# Altium schematic sheet Supply.SchDoc
size A4
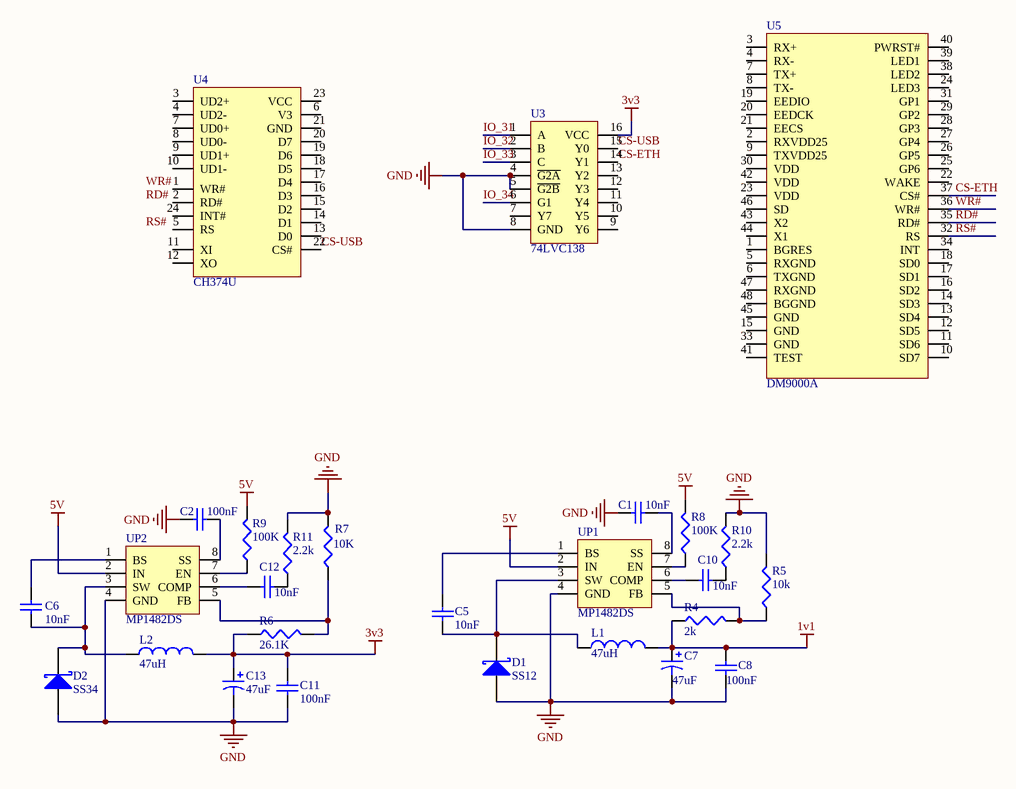
[diagram p0: Supply.SchDoc]

## Parts
C1  value 10nF  [6-0805_M]  (hidden comment: Cap)
C2  value 100nF  [6-0805_M]  (hidden comment: Cap)
C5  value 10nF  [6-0805_M]  (hidden comment: Cap)
C6  value 10nF  [6-0805_M]  (hidden comment: Cap)
C7  value 47uF  [TanCap-1210]  (hidden comment: Cap Pol3)
C8  value 100nF  [6-0805_M]  (hidden comment: Cap)
C10  value 10nF  [6-0805_M]  (hidden comment: Cap)
C11  value 100nF  [6-0805_M]  (hidden comment: Cap)
C12  value 10nF  [6-0805_M]  (hidden comment: Cap)
C13  value 47uF  [TanCap-1210]  (hidden comment: Cap Pol3)
D1  SS12  [SMB]
D2  SS34  [SMB]
L1  value 47uH  [PIND2020]  (hidden comment: Inductor)
L2  value 47uH  [PIND2020]  (hidden comment: Inductor)
R4  value 2k  [6-0805_M]  (hidden comment: Res3)
R5  value 10k  [6-0805_M]  (hidden comment: Res3)
R6  value 26.1K  [6-0805_M]  (hidden comment: Res3)
R7  value 10K  [6-0805_M]  (hidden comment: Res3)
R8  value 100K  [6-0805_M]  (hidden comment: Res3)
R9  value 100K  [6-0805_M]  (hidden comment: Res3)
R10  value 2.2k  [6-0805_M]  (hidden comment: Res3)
R11  value 2.2k  [6-0805_M]  (hidden comment: Res3)
U3  74LVC138
U4  CH374U
U5  DM9000A
UP1  MP1482DS  [SOP8N-127P600X200]
UP2  MP1482DS  [SOP8N-127P600X200]

## Nets
1v1: C7.1 C8.2 L1.2 R4.1
3v3: C11.2 C13.1 L2.2 R6.1 U3.16(VCC)
5V: R8.2 R9.2 UP1.2(IN) UP2.2(IN)
GND: C1.1 C2.1 C7.2 C8.1 C11.1 C13.2 D1.1(A) D2.1(A) R5.2 R7.2 R10.2 R11.2 U3.4(~{G2A}) U3.5(~{G2B}) U3.8(GND) UP1.4(GND) UP2.4(GND)
CS-ETH: U3.14(Y1) U5.37(CS#)
CS-USB: U3.15(Y0) U4.22(CS#)
IO_31: U3.1(A)
IO_32: U3.2(B)
IO_33: U3.3(C)
IO_34: U3.6(G1)
RD#: U5.35(RD#)
RS#: U5.32(RS)
WR#: U5.36(WR#)
NetC1_2: C1.2 UP1.8(SS)
NetC2_2: C2.2 UP2.8(SS)
NetC5_1: C5.1 D1.2(K) L1.1 UP1.3(SW)
NetC5_2: C5.2 UP1.1(BS)
NetC6_1: C6.1 D2.2(K) L2.1 UP2.3(SW)
NetC6_2: C6.2 UP2.1(BS)
NetC10_1: C10.1 UP1.6(COMP)
NetC10_2: C10.2 R10.1
NetC12_1: C12.1 UP2.6(COMP)
NetC12_2: C12.2 R11.1
NetR4_2: R4.2 R5.1 UP1.5(FB)
NetR6_2: R6.2 R7.1 UP2.5(FB)
NetR8_1: R8.1 UP1.7(EN)
NetR9_1: R9.1 UP2.7(EN)

Not connected (* = marked no-connect by the designer): U3 7(Y7) 9(Y6) 10(Y5) 11(Y4) 12(Y3) 13(Y2); U4 1(WR#) 2(RD#) 3(UD2+) 4(UD2-) 5(RS) 6(V3) 7(UD0+) 8(UD0-) 9(UD1+) 10(UD1-) 11(XI) 12(XO) 13(D0) 14(D1) 15(D2) 16(D3) 17(D4) 18(D5) 19(D6) 20(D7) 21(GND) 23(VCC) 24(INT#); U5 1(BGRES) 2(RXVDD25) 3(RX+) 4(RX-) 5(RXGND) 6(TXGND) 7(TX+) 8(TX-) 9(TXVDD25) 10(SD7) 11(SD6) 12(SD5) 13(SD4) 14(SD3) 15(GND) 16(SD2) 17(SD1) 18(SD0) 19(EEDIO) 20(EEDCK) 21(EECS) 22(WAKE) 23(VDD) 24(LED3) 25(GP6) 26(GP5) 27(GP4) 28(GP3) 29(GP2) 30(VDD) 31(GP1) 33(GND) 34(INT) 38(LED2) 39(LED1) 40(PWRST#) 41(TEST) 42(VDD) 43(X2) 44(X1) 45(GND) 46(SD) 47(RXGND) 48(BGGND)

## Notes on the sheet
- Labels drawn without touching a wire or pin: RD#, RS#, WR#

## Library data of the parts
C1 C2 C5 C6 C8 C10-C12 = Cap: Capacitor; Published: 8-Jun-2000; LatestRevisionDate: 17-Jul-2002; LatestRevisionNote: Re-released for DXP Platform.; PackageReference: RAD-0.3; Publisher: Altium Limited; PackageDescription: Radial Cap, Thru-Hole; 2 Leads; 0.3 in Pin Spacing
C7 C13 = Cap Pol3: Polarized Capacitor (Surface Mount); Published: 8-Jun-2000; LatestRevisionDate: 29-May-2009; LatestRevisionNote: IPC-7351 Footprint Added.; PackageReference: C0805; Publisher: Altium Limited; PackageDescription: Chip Capacitor
D1 D2 = D Schottky: Schottky Diode; Published: 8-Jun-2000; LatestRevisionDate: 17-Jul-2002; LatestRevisionNote: Re-released for DXP Platform.; PackageReference: SMB; Publisher: Altium Limited; PackageDescription: DO-214-AA/SMB; 2 C-Bend Leads; Body 5.3 x 3.6 mm, inc. leads (LxW); Code_JEDEC: DO-214-AA
L1 L2 = Inductor: Code_IEC: 1005; Published: 8-Jun-2000; LatestRevisionDate: 29-May-2009; LatestRevisionNote: IPC-7351 Footprint Added.; PackageReference: 0402-A; Publisher: Altium Limited; PackageDescription: Chip Inductor; Code_JEITA: 0402
R4-R11 = Res3: Resistor; Published: 8-Jun-2000; LatestRevisionDate: 29-May-2009; LatestRevisionNote: IPC-7351 Footprint Added.; PackageReference: J1-0603; Publisher: Altium Limited; PackageDescription: Chip Resistor
U3 = 74x138